# EAGLE design Debugger V1.1 (EAGLE 9.6.1)
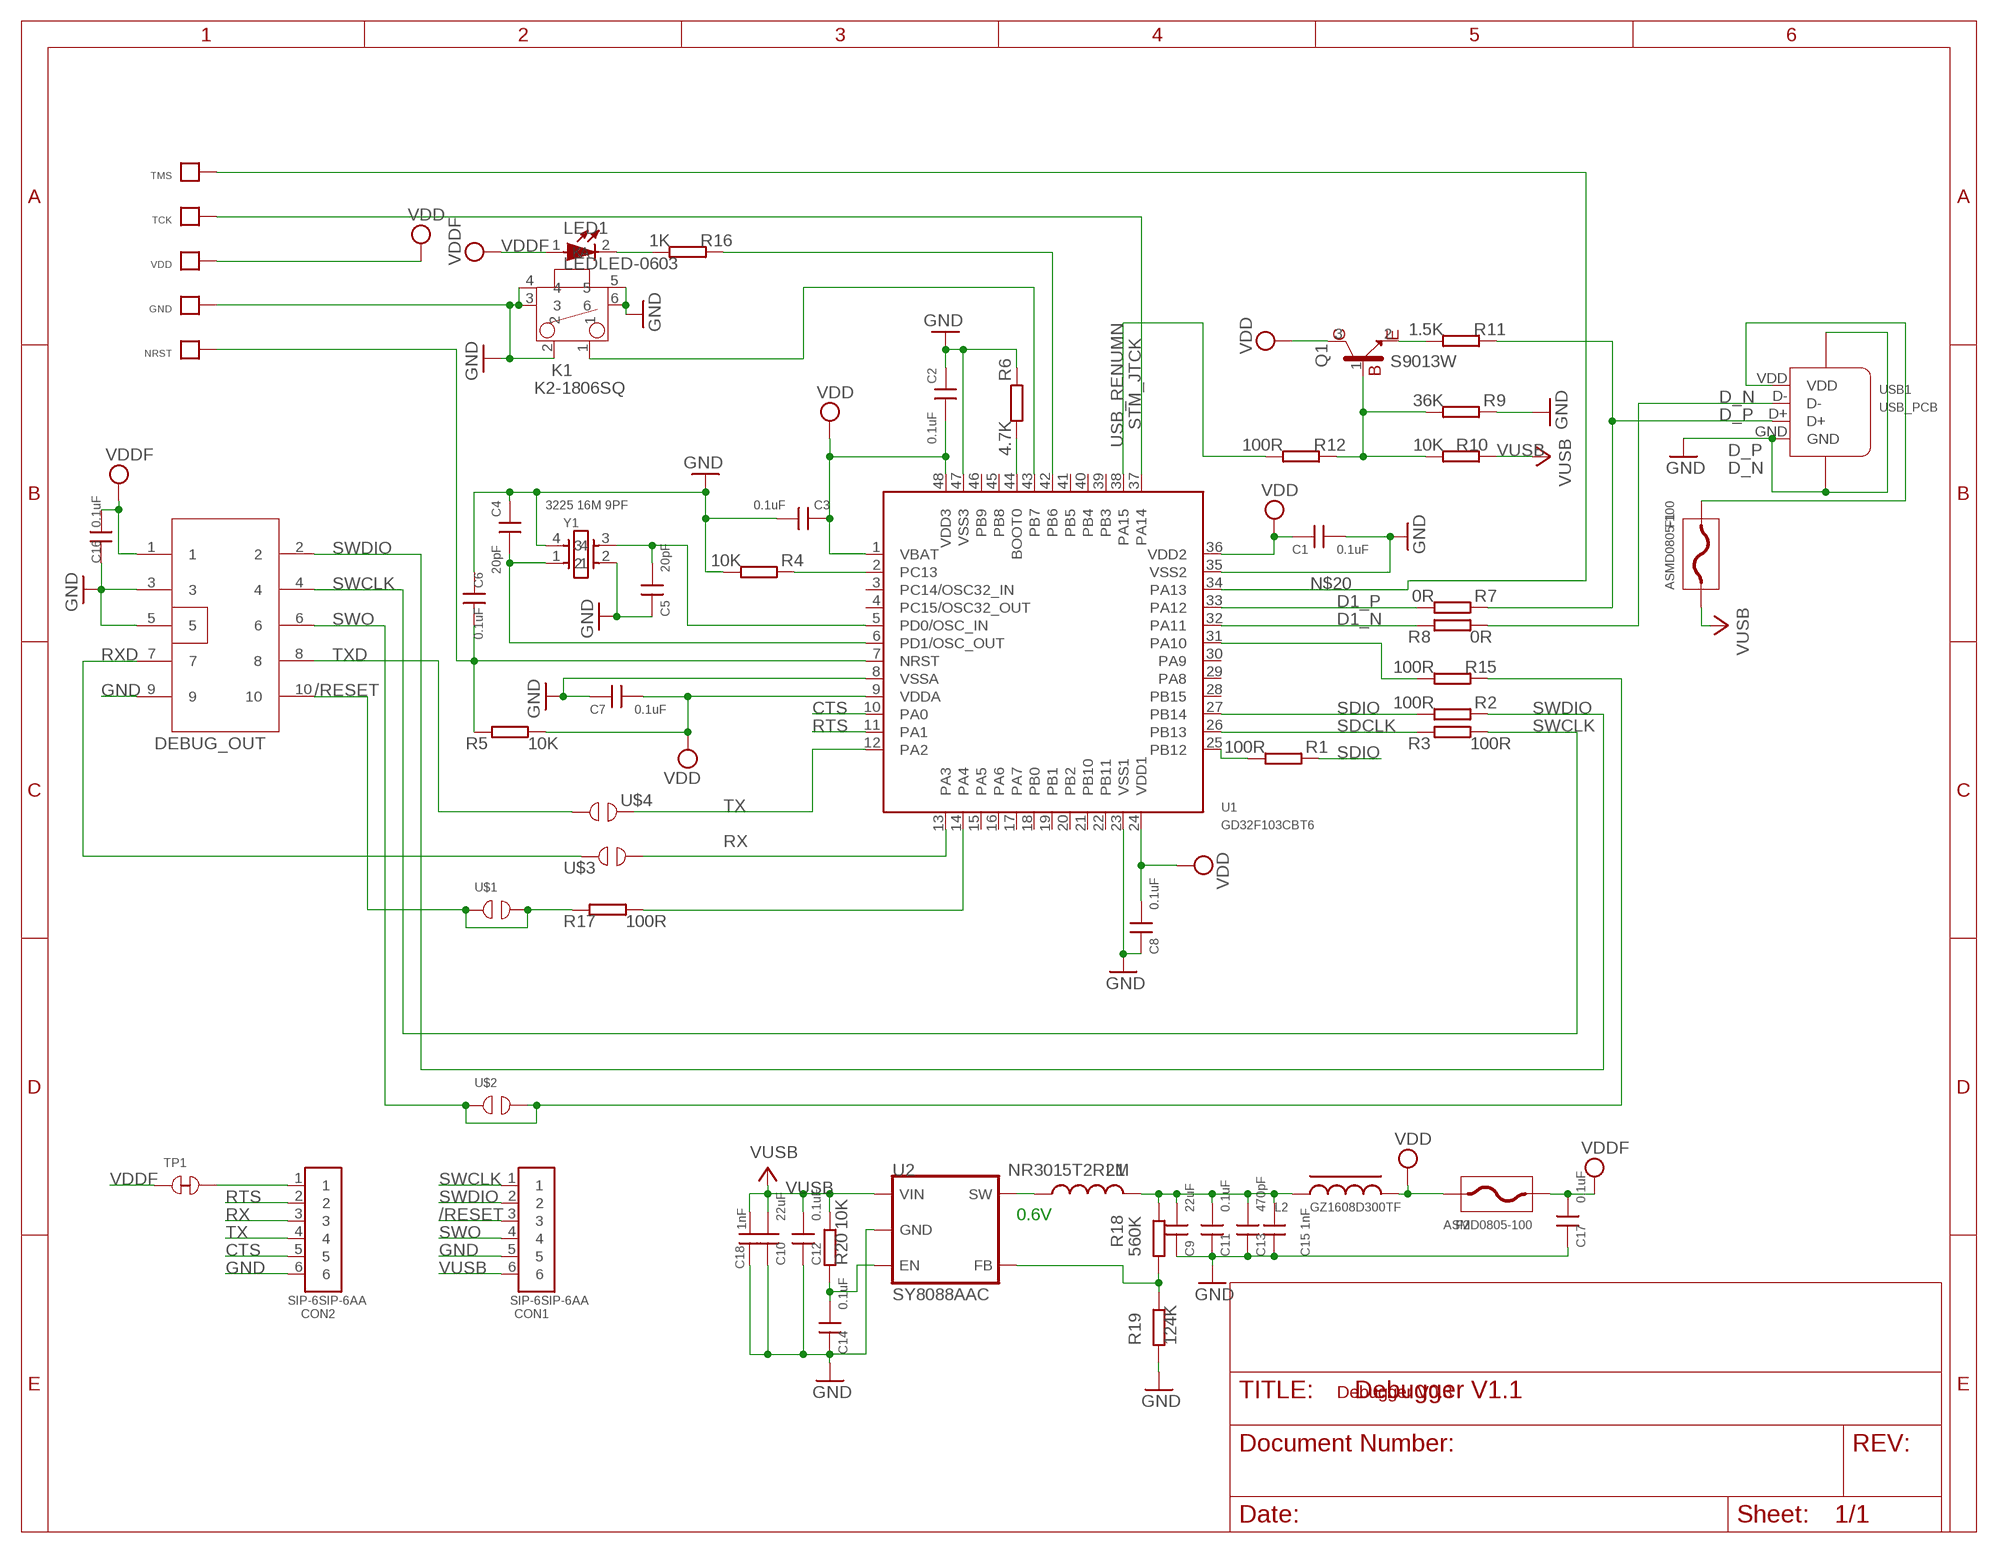
[diagram p0: schematic, sheet 1]

## Parts
C1  0.1uF  CAP0402A  [C0402]
C2  0.1uF  CAP0402A  [C0402]
C3  0.1uF  CAP0402A  [C0402]
C4  20pF  CAP0402A  [C0402]
C5  20pF  CAP0402A  [C0402]
C6  0.1uF  CAP0402A  [C0402]
C7  0.1uF  CAP0402A  [C0402]
C8  0.1uF  CAP0402A  [C0402]
C9  22uF  CAPC0805  [C0805]
C10  22uF  CAPC0805  [C0805]
C11  0.1uF  CAP0402A  [C0402]
C12  0.1uF  CAP0402A  [C0402]
C13  470pF  CAP0402A  [C0402]
C14  0.1uF  CAP0402A  [C0402]
C15  1nF  CAP0402A  [C0402]
C16  0.1uF  CAP0402A  [C0402]
C17  0.1uF  CAP0402A  [C0402]
C18  1nF  CAP0402A  [C0402]
CON1  SIP-6SIP-6AA  [PAIZHEN6P_2.54AA]
CON2  SIP-6SIP-6AA  [PAIZHEN6P_2.54AA]
DEBUG_OUT  CON5X2  [CON5X2_1.27]
F1  ASMD0805-100  FUSE  [F0805]
F2  ASMD0805-100  FUSE  [F0805]
GND  TPTP  [TP]
K1  K2-1806SQ  K2-1806C  [K2-1806C]
L1  NR3015T2R2M  INDUCTORB  [INDUCTOR-NR3015]
L2  GZ1608D300TF  L  [R-0603A]
LED1  LEDLED-0603  [LED-0603]
NRST  TPTP  [TP]
Q1  S9013W  NPNSOT-323  [SOT-323]
R1  100R  RES0402S  [R-0402S]
R2  100R  RES0402S  [R-0402S]
R3  100R  RES0402S  [R-0402S]
R4  10K  RES0402S  [R-0402S]
R5  10K  RES0402S  [R-0402S]
R6  4.7K  RES0402S  [R-0402S]
R7  0R  RES0402S  [R-0402S]
R8  0R  RES0402S  [R-0402S]
R9  36K  RES0402S  [R-0402S]
R10  10K  RES0402S  [R-0402S]
R11  1.5K  RES0402S  [R-0402S]
R12  100R  RES0402S  [R-0402S]
R15  100R  RES0402S  [R-0402S]
R16  1K  RES0402S  [R-0402S]
R17  100R  RES0402S  [R-0402S]
R18  560K  RES0402S  [R-0402S]
R19  124K  RES0402S  [R-0402S]
R20  10K  RES0402S  [R-0402S]
TCK  TPTP  [TP]
TMS  TPTP  [TP]
TP1  TP_SHORT  [TP_SHORT]
U1  GD32F103CBT6  STM32F103LQFP48  [LQFP-48-7X7]
U2  SY8088AAC  AX3701ABA  [SOT23-5L]
U$1  TP_OPEN  [TP_OPEN]
U$2  TP_OPEN  [TP_OPEN]
U$3  TP_OPEN  [TP_OPEN]
U$4  TP_OPEN  [TP_OPEN]
USB1  USB_PCB  [USB_PCB]
VDD  TPTP  [TP]
Y1  3225 16M 9PF  CRY-3225CRY-3225  [CRY_3225_SMT]

## Nets
/RESET: CON1.3 DEBUG_OUT.10 R17.1 U$1.1 U$1.2
CTS: CON2.5 U1.10(PA0)
D1_N: R8.1 U1.32(PA11)
D1_P: R7.2 U1.33(PA12)
D_N: R8.2 USB1.D-
D_P: R7.1 R11.1 USB1.D+
GND: C1.1 C2.2 C3.1 C4.2 C5.2 C6.2 C7.2 C8.2 C9.2 C10.2 C11.2 C12.2 C13.2 C14.2 C15.2 C16.2 C17.2 C18.2 CON1.5 CON2.6 DEBUG_OUT.3 DEBUG_OUT.5 DEBUG_OUT.9 GND.P$1 K1.2 K1.3 K1.4 K1.5 K1.6 R4.2 R6.1 R9.1 R19.1 U1.8(VSSA) U1.23(VSS1) U1.35(VSS2) U1.47(VSS3) U2.2(GND) USB1.GND USB1.GND1 USB1.GND2 Y1.2 Y1.4
N$1: R1.2 U1.25(PB12)
N$2: C6.1 NRST.P$1 R5.1 U1.7(NRST)
N$3: R4.1 U1.2(PC13)
N$5: C5.1 U1.5(PD0/OSC_IN) Y1.3
N$6: C4.1 U1.6(PD1/OSC_OUT) Y1.1
N$8: Q1.1(B) R9.2 R10.2 R12.1
N$9: R15.2 U1.31(PA10)
N$10: Q1.2(E) R11.2
N$11: R6.2 U1.44(BOOT0)
N$12: LED1.2(K) R16.2
N$13: F1.P$2 USB1.VDD
N$14: K1.1 U1.43(PB7)
N$15: R16.1 U1.42(PB6)
N$17: L1.1 U2.3(SW)
N$18: R17.2 U1.14(PA4)
N$20: TMS.P$1 U1.34(PA13)
N$21: R18.1 R19.2 U2.5(FB)
N$23: C14.1 R20.1 U2.1(EN)
N$24: C9.1 C11.1 C13.1 C15.1 L1.2 L2.1 R18.2
RTS: CON2.2 U1.11(PA1)
RX: CON2.3 U1.13(PA3) U$3.2
RXD: DEBUG_OUT.7 U$3.1
SDCLK: R3.1 U1.26(PB13)
SDIO: R1.1 R2.2 U1.27(PB14)
STM_JTCK: TCK.P$1 U1.37(PA14)
SWCLK: CON1.1 DEBUG_OUT.4 R3.2
SWDIO: CON1.2 DEBUG_OUT.2 R2.1
SWO: CON1.4 DEBUG_OUT.6 R15.1 U$2.1 U$2.2
TX: CON2.4 U1.12(PA2) U$4.1
TXD: DEBUG_OUT.8 U$4.2
USB_RENUMN: R12.2 U1.38(PA15)
VDD: C1.2 C2.1 C3.2 C7.1 C8.1 F2.P$2 L2.2 Q1.3(C) R5.2 U1.1(VBAT) U1.9(VDDA) U1.24(VDD1) U1.36(VDD2) U1.48(VDD3) VDD.P$1
VDDF: C16.1 C17.1 CON2.1 DEBUG_OUT.1 F2.P$1 LED1.1(A) TP1.1 TP1.2
VUSB: C10.1 C12.1 C18.1 CON1.6 F1.P$1 R10.1 R20.2 U2.4(VIN)
Unconnected: U1.3(PC14/OSC32_IN) U1.4(PC15/OSC32_OUT) U1.15(PA5) U1.16(PA6) U1.17(PA7) U1.18(PB0) U1.19(PB1) U1.20(PB2) U1.21(PB10) U1.22(PB11) U1.28(PB15) U1.29(PA8) U1.30(PA9) U1.39(PB3) U1.40(PB4) U1.41(PB5) U1.45(PB8) U1.46(PB9)

## Notes on the sheet
- 0.6V
- Debugger V0.3

## Library data of the parts
C1-C18 = RedBear:CAP: CAP
CON1 CON2 = RedBear:SIP-6: SIP-6
DEBUG_OUT = RedBear:CON5X2
F1 F2 = RedBear:FUSE
GND NRST TCK TMS VDD = RedBear:TP
K1 = RedBear:K2-1806C
L1 = Particle:INDUCTOR
L2 = RedBear:L
LED1 = RedBear DUO:LED: LED
Q1 = RedBear:NPN
R1-R12 R15-R20 = RedBear:RES: RES
TP1 = RedBear:TP_SHORT
U1 = RedBear:STM32F103
U2 = Particle:AX3701ABA
U$1-U$4 = RedBear:TP_OPEN
USB1 = RedBear:USB_PCB
Y1 = RedBear:CRY-3225: CRY-3225

## Board
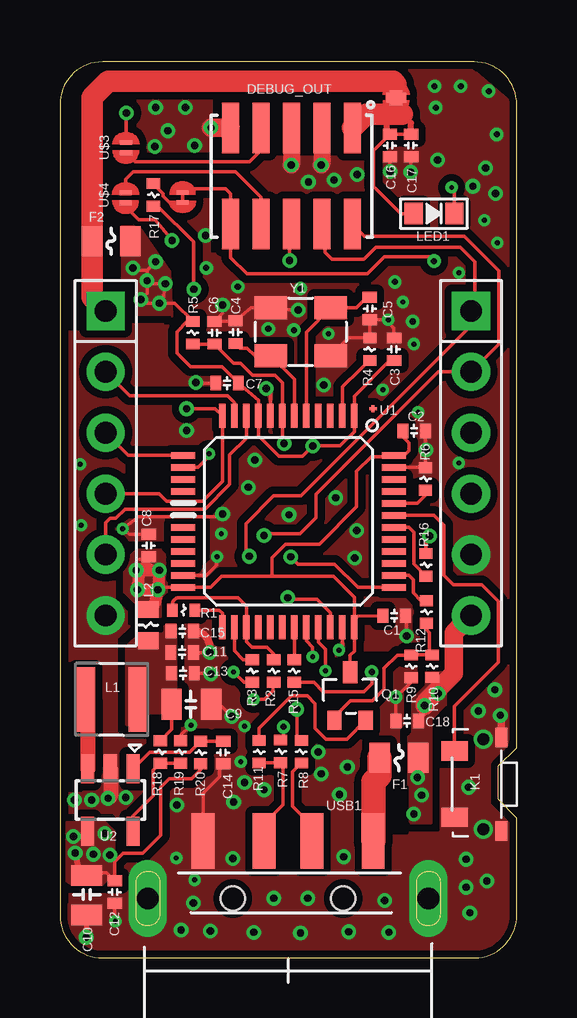
[diagram p1: board, top side]
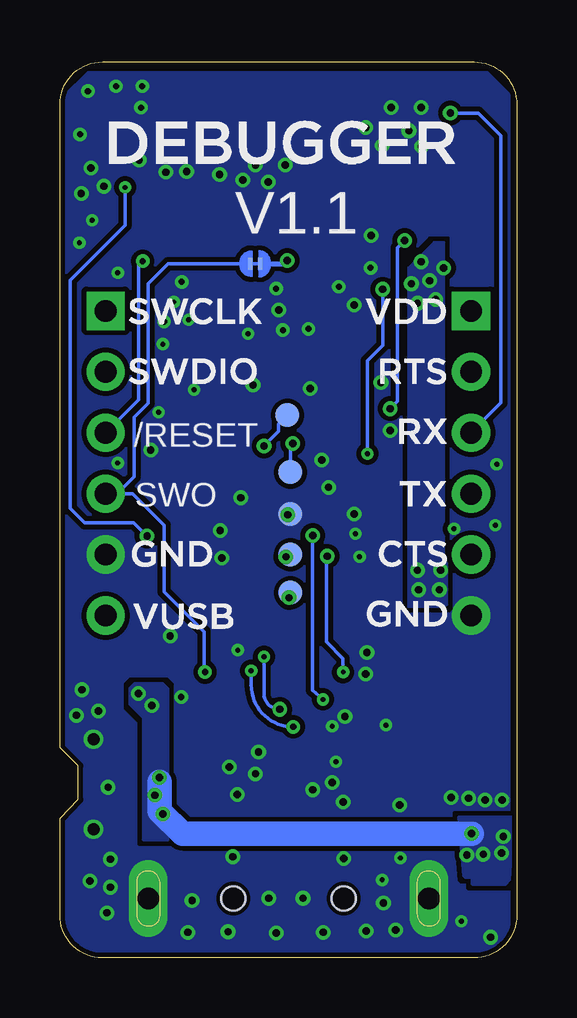
[diagram p2: board, bottom side, seen from below]

Size 19.05 x 37.34 mm. Coordinates in mm from the lower left corner, seen from the top.
Outline: 19.05,5.82 18.29,6.6 18.29,8 19.05,8.76 19.05,35.56 arc90 17.27,37.34 1.78,37.34 arc90 0,35.56 0,1.78 arc90 1.78,0 17.3,0 arc90 19.05,1.8 19.05,5.82
Copper layers (1*16): Top 0.035mm / dielectric 1.5mm / Bottom 0.035mm
Design rules "default *": minimum track width 6mil, minimum drill 0.2mm, track to track 6mil, track to pad 6mil, pad to pad 6mil, via to via 6mil, smd to smd 6mil, copper to edge 8mil, drill to drill 12mil, minimum pad ring 6mil, minimum via ring 6mil, stop-mask expansion 0.005mm, vias tented up to drill 16mil, thermal gap 4mil

### Footprints (pad centres in the part's own frame; a part is rotated, then mirrored left to right if it is on the bottom)
C0402 = smd 0.45 x 0.6: 1 -0.47,0; 2 0.47,0
C0805 = smd 0.85 x 1.3: 1 -0.8,0; 2 0.85,0
PAIZHEN6P_2.54AA = drill 0.9 pad 1.6 square: 1 0,0 | drill 0.9 pad 1.6: 2 0,-2.54; 3 0,-5.08; 4 0,-7.62; 5 0,-10.16; 6 0,-12.7
CON5X2_1.27 = smd 0.7 x 2.1: 1 -2.54,-2; 2 -2.54,2; 3 -1.27,-2; 4 -1.27,2; 5 0,-2; 6 0,2; 7 1.27,-2; 8 1.27,2; 9 2.54,-2; 10 2.54,2
F0805 = smd 0.85 x 1.25: P$1 -0.8,0; P$2 0.8,0
TP = smd 1 x 1: P$1 0,0
K2-1806C = smd 0.8 x 1.1: 1 -1.38,-1.2; 2 1.38,-1.2 | drill 0.5 pad 0.7: 3 1.875,0; 6 -1.875,0 | smd 0.8 x 0.5: 4 1.95,0.75; 5 -1.95,0.75
INDUCTOR-NR3015 = smd 0.8 x 2.7: 1 -1.1,0; 2 1.1,0
R-0603A = smd 0.7 x 0.85: 1 -0.65,0; 2 0.65,0
LED-0603 = smd 0.762 x 0.889: 1 -0.85,0; 2 0.85,0
SOT-323 = smd 0.6 x 0.8: 1 -0.65,-1; 2 0.65,-1 | smd 0.6 x 0.9: 3 0,1
R-0402S = smd 0.45 x 0.55: 1 -0.47,0; 2 0.47,0
TP_SHORT = smd 0.2 x 0.5: 1 -0.21,0; 2 0.21,0 | smd 0.4 x 0.8: P$1 0,0
LQFP-48-7X7 = smd 1 x 0.27: 1 -4.4,2.75; 2 -4.4,2.25; 3 -4.4,1.75; 4 -4.4,1.25; 5 -4.4,0.75; 6 -4.4,0.25; 7 -4.4,-0.25; 8 -4.4,-0.75; 9 -4.4,-1.25; 10 -4.4,-1.75; 11 -4.4,-2.25; 12 -4.4,-2.75; 25 4.4,-2.75; 26 4.4,-2.25; 27 4.4,-1.75; 28 4.4,-1.25; 29 4.4,-0.75; 30 4.4,-0.25; 31 4.4,0.25; 32 4.4,0.75; 33 4.4,1.25; 34 4.4,1.75; 35 4.4,2.25; 36 4.4,2.75 | smd 0.27 x 1: 13 -2.75,-4.4; 14 -2.25,-4.4; 15 -1.75,-4.4; 16 -1.25,-4.4; 19 0.25,-4.4; 20 0.75,-4.4; 21 1.25,-4.4; 22 1.75,-4.4; 23 2.25,-4.4; 24 2.75,-4.4; 37 2.75,4.4; 38 2.25,4.4; 39 1.75,4.4; 40 1.25,4.4; 41 0.75,4.4; 42 0.25,4.4; 43 -0.25,4.4; 44 -0.75,4.4; 45 -1.25,4.4; 46 -1.75,4.4; 47 -2.25,4.4; 48 -2.75,4.4 | smd 0.127 x 0.3: 17 -4.694,3.538 | smd 0.3 x 0.127: 18 -4.692,3.534
SOT23-5L = smd 0.55 x 1.2: 1 -0.95,-1.3; 2 0,-1.3; 3 0.95,-1.3; 4 0.95,1.3; 5 -0.95,1.3
TP_OPEN = smd 0.2 x 0.5: 1 -0.21,0; 2 0.21,0
USB_PCB = smd 0.95 x 2.3: D+ -1.009,5.384; D- 0.991,5.384; GND -3.559,5.384; VDD 3.541,5.384 | drill 0.9 pad 1.6 long: GND1 5.841,2.984; GND2 -5.859,2.984 | hole 1: -2.309,2.984; 2.291,2.984
CRY_3225_SMT = smd 1.35 x 0.95: 1 -1.25,-1; 2 1.25,-1; 3 1.25,1; 4 -1.25,1

### Placement (x,y rotation side)
C1  13.94,14.26 180 top
C2  14.77,21.96 0 top
C3  13.93,25.36 270 top
C4  7.32,26.07 90 top
C5  12.92,27.06 270 top
C6  6.45,26.05 90 top
C7  6.97,23.95 180 top
C8  3.71,17.18 90 top
C9  5.46,10.57 0 top
C10  1.12,2.64 270 top
C11  5.1,12.73 0 top
C12  2.29,2.74 270 top
C13  5.13,11.86 0 top
C14  6.81,8.56 270 top
C15  5.11,13.61 0 top
C16  13.76,33.85 270 top
C17  14.64,33.85 270 top
C18  14.48,9.88 180 top
CON1  17.14,26.96 0 top
CON2  1.91,26.96 0 top
DEBUG_OUT  9.65,32.58 180 top
F1  14.13,8.34 180 top
F2  2.13,29.87 0 top
GND  9.44,18.49 180 bottom
K1  17.65,7.24 270 top
L1  2.16,10.77 0 top
L2  3.68,13.87 90 top
LED1  15.6,31.01 0 top
NRST  9.44,20.24 0 bottom
Q1  12.1,10.9 0 top
R1  5.16,14.49 0 top
R2  8.92,11.95 90 top
R3  8.02,11.95 270 top
R4  12.92,25.36 90 top
R5  5.55,26.05 90 top
R6  15.24,19.96 270 top
R7  9.2,8.61 90 top
R8  10.07,8.59 270 top
R9  14.64,12.15 90 top
R10  15.52,12.15 90 top
R11  8.31,8.59 90 top
R12  15.28,14.41 90 top
R15  9.77,11.95 90 top
R16  15.27,16.38 90 top
R17  3.89,31.8 270 top
R18  4.19,8.59 90 top
R19  5.03,8.59 270 top
R20  5.87,8.56 270 top
TCK  9.44,16.81 0 bottom
TMS  9.44,15.22 0 bottom
TP1  14.02,35.84 90 top
U1  9.53,18.19 270 top
U2  2.11,6.58 180 top
U$1  5.11,31.69 270 top
U$2  10.91,28.93 180 bottom
U$3  2.75,33.77 90 top
U$4  2.74,31.68 90 top
U$5  SPARK_LOGO2  [SPARK_LOGO2]  10.62,6.16 0 bottom
U$6  SPARK_LOGO2  [SPARK_LOGO2]  15.8,33.59 0 top
USB1  9.53,-0.51 0 top
VDD  9.56,22.61 0 bottom
Y1  10.04,26.09 0 top

### Tracks (layer width: path | path; a pad name or v marks a point on that pad's centre or on a via)
/RESET  (via drill 0.25 pad 0.51)
  Top 0.152: R17.1 4.31,31.85 4.31,31.73 4.57,31.48 U$1.2 U$1.1 5.27,32.05 6.91,32.05 7.11,31.85 DEBUG_OUT.10 7.11,29.18 7.8,28.5 12.83,28.5 13.54,29.21 15.42,29.21 v15.6,29.03
  Bottom 0.152: CON1.3 15.77,23.25 15.77,28.85 v15.6,29.03
CTS
  Top 0.152: U1.10 7.78,21.66 7.08,20.97 7.08,19.73 6.04,18.69 2.71,18.69 2.33,18.31 2.08,18.31 1.91,18.14 CON2.5
D1_N  (via drill 0.2 pad 0.41, 0.3 pad 0.51)
  Top 0.152: R8.1 arc-90 9.88,9.25 v9.88,10.36 | U1.32 10.28,13.22 10.54,12.95 v10.54,12.55
  Bottom 0.152: v10.54,12.55 10.54,11.02 arc-90 v9.88,10.36
D1_P  (via drill 0.2 pad 0.41, 0.25 pad 0.51)
  Top 0.152: 9.32,9.2 arc-90 R7.2 9.32,9.2 | U1.33 10.78,13.15 11.07,12.85 11.07,12.12 v11.07,11.96 | 9.32,9.2 v9.32,9.63
  Bottom 0.152: v11.07,11.96 11.07,11.38 arc-90 v9.32,9.63
D_N
  Top 0.152: R8.2 9.7,7.76 9.7,6.32 9.93,6.1 10.52,5.51 USB1.D-
D_P
  Top 0.152: R11.1 9.19,8.12 R7.1 9.31,8.03 9.31,6.39 8.66,5.74 8.66,5.03 USB1.D+
GND  (via drill 0.2 pad 0.41, 0.25 pad 0.51, 0.3 pad 0.51)
  Top 0.152: Y1.2 12.03,25.83 R4.2 C5.2 v13.69,26.59 13.69,26.48 13.93,26.24 C3.1 | USB1.GND 5.97,5.18 5.97,5.19 5.97,6.86 6.66,7.54 6.66,7.94 C14.2 | C1.1 arc-90 14.45,14.21 v14.45,13.41 | U1.8 8.78,23.56 v8.61,23.72 | C7.2 5.69,23.95 v5.66,23.98 | v9.93,27 8.88,27 Y1.4 7.97,27.09 C4.2 7.3,26.52 C6.2 6.78,26.86 v6.78,27.2 | C16.2 v13.76,32.77 v13.77,32.77 | C17.2 14.63,33.37 v14.63,32.74 | C9.2 6.65,10.57 v7.16,10.06 | C8.2 2.9,17.65 v2.62,17.88 3.28,18.39 6.68,18.39 v6.78,18.49 | C2.2 15.24,21.18 v15.27,21.16 15.24,21.13 R6.1 15.23,20.44 U1.47 | U1.35 11.78,12.97 v11.63,12.83 | C18.2 14.01,10.86 | v14,10.87 14.01,10.86 | v5.46,9.7 5.03,9.27 R19.1 | C12.2 2.29,1.55 v2.31,1.52 | v6.55,16.71 6.53,16.69 6.53,16.36 6.11,15.94 U1.23 | C11.2 v6.25,12.73 | C13.2 6.27,11.86 v6.3,11.84 | R9.1 14.64,11.49 14.01,10.86
  Top 0.203: C10.2 1.09,1.77 v1.09,0.86
  Top 0.305: C15.2 arc-90 6.25,12.94 v6.25,12.73 | K1.5 18.4,10.07 v18.36,10.11
  Top 0.635: U2.2 2.11,6.76 v2.01,6.66
  Top 0.711: DEBUG_OUT.5 v9.65,33.05 | DEBUG_OUT.3 10.92,33.07 v10.9,33.05
  Top 0.762: DEBUG_OUT.9 6.31,34.58 v6.3,34.6
  other vias: 16.94,4.11 17.09,1.88 14.71,26.52 12.37,17.81 4.88,6.38 7.7,7.32 10.34,2.49 10.9,7.67 8.92,2.49 5.56,2.29 11.66,6.81 11.51,19.18 8.13,20.75 17.04,7.11 1.32,6.58 0.61,6.58 6.07,30.1 2.74,6.68 11,23.88 17.81,3.2 13.54,2.39 6.27,1.12 12.04,1.09 12.29,16.66 11.99,7.95 10.77,8.59 8.51,7.01 7.24,6.5 8.08,1.07 10.03,1.04 13.72,1.07 16.94,2.95 11.84,4.22 7.21,4.14 7.85,19.61 9.55,18.47 10.36,32.33 11.43,32.41 12.4,32.64 15.75,33.25 17.75,32.92 17.22,32.16 18.16,31.85 5.61,33.86 5.23,35.43 3.99,35.43 4.5,34.47 3.96,33.81 17.45,10.29 18.14,11.18 5.28,21.97 11.2,26.01 13.46,23.67 16.64,28.55 14.3,27.33 14.94,22.73 16.64,20.62 0.89,18.03 0.84,20.57 6.73,17.68 7.7,9.65 7.54,8.18 6.1,28.75 17.7,30.73 4.85,4.17 5.61,3.25 5.05,1.17 15.62,36.32 16.71,36.32 15.67,35.43 17.88,36.12 18.21,34.32 18.24,29.79 7.42,27.97 10.03,27.89 13.97,28.17 9.75,26.16 8.69,26.21 14.76,25.58
  cutout Top: 1.78,30.51 1.78,28.32 1.91,28.19 2.54,28.19 2.54,30.51
  pour Top (isolate 0.305, rank 3, no thermals): 0.36,2.21 0.36,0.33 0.41,0.28 18.44,0.28 18.75,0.58 18.75,5.56 17.91,6.4 17.91,8.15 18.59,8.59 18.87,10.34 18.9,35.56 17.37,36.86 17.3,36.86 17.09,37.06 1.68,37.06 0.43,35.81 0.43,2.29
  pour Bottom (isolate 0.203, rank 3, no thermals): 0.3,0.25 18.36,0.25 18.85,0.74 18.85,5.77 18.82,5.79 18.08,6.53 18.08,7.62 18.08,8.13 18.85,8.89 18.85,35.92 17.88,36.88 1.27,36.88 1.24,36.91 0.33,35.99 0.33,0.3
  cutout Top (isolate 0.203): 13.44,15.29 12.93,15.29 12.93,20.47 13.16,20.7 13.44,20.7
  cutout Top (isolate 0.203): 5.56,16.41 5.61,21.29 6.2,21.29 6.2,16.61 6.02,16.43 5.82,16.43 5.79,16.41
  cutout Top: 10.52,15.06 10.52,14.3 12.42,14.3 12.42,15.09 10.54,15.09
  cutout Top: 9.02,5.99 9.04,3.56 10.06,3.56 10.08,3.81 10.08,5.99
  cutout Top: 8.1,8.86 8.1,8.36 8.13,8.33 10.29,8.33 10.29,8.86
  cutout Top (isolate 0.254): 6.43,36.09 6.43,33.48 12.55,33.48 12.55,36.09
  cutout Top (isolate 0.254): 6.35,31.7 6.35,29.44 12.9,29.44 12.9,31.7
  pour Top (isolate 0.203): 7.8,12.22 7.8,11.71 10.21,11.71 10.21,12.22 10.19,12.24 7.8,12.24
  cutout Top: 0.1,36.32 0.1,26.24 0.15,26.19 0.91,26.19 0.91,36.3 0.89,36.32
N$1
  Top 0.152: R1.2 6.64,14.49 6.78,14.36 U1.25
N$2  (via drill 0.3 pad 0.51)
  Top 0.152: v9.35,21.44 9.28,21.51 U1.7 9.28,23.97 8.97,24.28 8.04,24.28 7.54,24.78 7.24,24.78 C6.1 R5.1
  Bottom 0.152: NRST.P$1 9.44,21.35 v9.35,21.44
N$3
  Top 0.152: U1.2 11.78,23.81 12.51,24.5 12.9,24.89 R4.1
N$4
  cutout Top (isolate 0.305): 2.79,20.83 2.79,18.8 4.57,18.8 4.57,20.83
N$5
  Top 0.152: U1.5 10.28,26.08 Y1.3 12.36,27.09 12.8,27.53 C5.1
N$6
  Top 0.152: U1.6 9.78,24.11 Y1.1 8.13,25.09 7.81,25.41 7.51,25.41 C4.1
N$7
  cutout Top (isolate 0.254): 7.8,12.27 7.8,11.73 10.74,11.73 10.74,12.27
N$8
  Top 0.152: R12.1 15.28,13.69 15.41,13.56 15.41,12.73 R10.2 R9.2 14.07,12.62 13.51,12.07 13.51,11.2 13.03,10.72 12.11,10.72 11.45,10.06 Q1.1
N$9
  Top 0.152: R15.2 | R15.2 U1.31
N$10
  Top 0.152: R11.2 8.3,9.57 9.65,10.92 10.31,10.92 10.64,10.59 10.64,9.58 11.1,9.12 11.96,9.12 Q1.2
N$11
  Top 0.152: U1.44 14.9,18.94 15.24,19.28 R6.2
N$12  (via drill 0.2, 0.3 pad 0.51)
  Top 0.152: R16.2 15.27,17.43 v15.42,17.58 | LED1.2 16.45,31.99 v16.33,32.11
  Bottom 0.152: v15.42,17.58 15.98,18.14 18.01,18.14 18.62,18.74 18.62,28.24 16.33,30.53 v16.33,32.11
N$13
  Top 1.016: USB1.VDD 13.07,7.33 13.33,7.59 F1.P$2
N$14
  Top 0.152: K1.1 16.45,10.48 18.29,12.32 18.29,14.86 17.6,15.55 16.41,15.55 16,15.95 16,18.03 15.6,18.44 U1.43
N$15
  Top 0.152: R16.1 14.76,16.42 14.76,17.73 14.55,17.94 U1.42
N$17
  Top 0.635: L1.1 1.16,10.67 U2.3
N$18  (via drill 0.2 pad 0.41, 0.3 pad 0.51)
  Top 0.152: U1.14 5.77,20.44 6.22,20.89 v6.22,21.01 | R17.2 4.08,31.33 5.56,29.84 5.56,27.89 v5.59,27.86
  Bottom 0.152: v5.59,27.86 5.59,25.53 6.22,24.89 v6.22,21.01
N$19
  cutout Top (isolate 0.305): 13.72,7.11 13.72,5.21 14.48,5.21 14.48,7.11
N$20  (via drill 0.3 pad 0.51)
  Top 0.152: U1.34 11.28,14.38 10.72,14.93 9.58,14.93 v9.5,15.01
  Bottom 0.152: TMS.P$1 9.5,15.16 v9.5,15.01
N$21
  Top 0.152: U2.5 3.06,5.93 3.89,6.76 3.89,7.81 R18.1 R19.2
N$22
  cutout Top (isolate 0.305): 12.7,12.7 12.7,11.43 13.34,11.43 13.59,11.43 13.59,12.7
N$23
  Top 0.152: U2.1 3.75,8.57 5.41,8.57 R20.1 C14.1
N$24
  Top 0.152: R18.2 4.66,9.52 C9.1
  pour Top (isolate 0.203, no thermals): 2.77,12.55 2.77,9.73 2.79,9.7 3.58,9.7 3.66,9.78 3.66,10.13 3.71,10.19 4.83,10.19 4.85,10.21 4.85,13.84 4.83,13.87 4.42,13.87 4.37,13.82 4.37,13.61 4.27,13.51 3.3,13.51 2.77,12.98
N$25
  cutout Top (isolate 0.305): 0.25,8.64 0.25,6.99 0.89,6.99 0.89,8.64
RTS
  Top 0.152: U1.11 7.28,23.13 6.99,23.42 2.91,23.42 CON2.2
RX  (via drill 0.3 pad 0.51)
  Top 0.152: U1.13 2.85,20.94 CON2.3 | v2.77,35.2 2.74,35.2 2.75,35.2 U$3.2
  Bottom 0.152: CON2.3 0.66,23.13 0.66,34.27 1.6,35.2 v2.77,35.2
RXD
  Top 0.152: U$3.1 3.13,33.17 7.9,33.17 8.38,33.66 DEBUG_OUT.7
SDCLK
  Top 0.152: U1.26 7.28,12.79 7.64,12.42 R3.1
SDIO
  Top 0.152: R2.2 8.92,12.67 8.64,12.95 8,12.95 7.78,13.18 U1.27 7.78,14.65 7.42,15.01 4.98,15.01 arc90 4.69,14.72 R1.1
STM_JTCK  (via drill 0.3 pad 0.51)
  Top 0.152: U1.37 12.43,15.44 11.46,16.41 9.93,16.41 v9.63,16.71
  Bottom 0.152: TCK.P$1 9.53,16.81 v9.63,16.71
SWCLK  (via drill 0.2 pad 0.41, 0.3 pad 0.51)
  Top 0.152: v7.9,16.74 7.76,16.88 7.76,18.1 8.92,19.25 10.06,19.25 17.14,26.34 CON1.1 17.3,27.12 17.3,29.01 16.69,29.62 13.18,29.62 12.68,29.11 11.35,29.11 11.05,29.41 11.05,30.45 DEBUG_OUT.4 | v7.24,11.91 7.67,11.48 R3.2
  Bottom 0.152: v7.24,11.91 7.24,12.47 7.94,13.17 7.94,16.7 v7.9,16.74
SWDIO  (via drill 0.2 pad 0.41, 0.3 pad 0.51)
  Top 0.152: R2.1 8.89,11.46 8.89,11.12 8.53,10.77 v8.08,10.77 | DEBUG_OUT.2 12.7,30.07 16.87,30.07 18.3,28.64 18.3,25.58 CON1.2 15.77,24.42 10.67,19.32 10.67,18.34 10.01,17.68 8.59,17.68 v8.51,17.6
  Bottom 0.152: v8.08,10.77 8.51,11.15 v8.51,17.6
SWO  (via drill 0.25 pad 0.51, 0.3 pad 0.51)
  Top 0.152: DEBUG_OUT.6 9.65,29.62 9.58,29.54 v9.58,29.06 | R15.1 10.59,11.48 10.97,11.1 12.68,11.1 13.01,11.43 v13.01,11.91
  Bottom 0.152: U$2.1 U$2.2 14.53,28.93 15.37,28.09 15.37,23.11 15.95,22.53 15.95,20.05 16.66,19.34 CON1.4 16.02,19.34 14.71,18.03 14.71,15.27 13.03,13.59 13.03,11.94 v13.01,11.91
  Bottom 0.203: U$2.1 9.71,28.93 v9.58,29.06
TX  (via drill 0.3 pad 0.51)
  Top 0.152: U$4.1 2.74,31.3 3.28,30.76 3.96,30.76 v4.67,29.9 | v5.28,22.88 6.48,22.88 U1.12 6.78,19.86 5.94,19.02 4.45,19.02 4.13,19.34 CON2.4
  Bottom 0.152: v4.67,29.9 4.98,29.59 4.98,23.19 v5.28,22.88
TXD
  Top 0.152: U$4.2 2.74,32.45 3.05,32.77 7.32,32.77 8.38,31.7 DEBUG_OUT.8
USB_RENUMN
  Top 0.152: U1.38 14.54,15.94 14.73,15.75 14.73,15.21 15.05,14.89 R12.2
VDD  (via drill 0.3 pad 0.51)
  Top 0.152: U1.36 12.28,14.1 12.42,14.24 C1.2 | v4.09,15.34 4.08,15.44 U1.24 6.27,15.44 6.74,15.9 8.84,15.9 | C8.1 3.46,16.61 3.33,16.61 | U1.36 12.28,15.03 11.41,15.9 8.84,15.9 | v4.14,27.28 4.29,27.43 v4.39,28.09 3.76,28.09 v3.63,28.22 | C2.1 14.3,21.72 14.55,21.46 14.55,21.13 14.36,20.94 U1.48 13.87,20.88 12.98,20.88 12.37,20.27 12.37,18.8 10.82,17.25 9.41,17.25 8.84,16.68 8.84,15.9 | v4.14,27.28 4.79,27.28 R5.2 5.31,26.52 4.88,26.09 4.88,25.2 5.44,24.63 6.76,24.63 C7.1 8.28,23.25 U1.9 8.28,21.75 9.13,20.9 10.11,20.9 v10.54,21.34 11.68,21.34 12.28,21.93 U1.1 12.28,23.41 13.76,24.89 C3.2 | Q1.3 12.1,12.61 12.28,12.79 U1.36 | v4.14,27.28 3.53,27.28 v3.38,27.43 3.63,27.69 v3.63,28.22 | v3.99,29.01 3.63,28.65 | 3.63,28.65 v3.63,28.22 | v3.05,28.75 3.15,28.65 3.63,28.65
  Top 0.254: C8.1 3.55,16.44 | 3.55,16.44 v4.14,16.15 | v3.18,16.15 3.33,16.21 3.55,16.44
  Top 0.508: L2.2 3.99,14.82 v4.09,15.34 | v4.09,15.34 v3.23,15.34 3.28,15.95 v3.18,16.15 v4.14,16.15 v4.09,15.34
  Bottom 0.152: v10.54,21.34 9.93,21.95 9.93,22.25 VDD.P$1
  pour Top (isolate 0.203, no thermals): 3.18,14.22 3.18,14.73 2.67,15.24 2.67,16.26 2.67,16.51 2.92,16.76 3.18,17.02 4.19,17.02 4.45,16.76 4.45,15.24 4.19,14.99 4.19,14.22
  pour Top (isolate 0.203, no thermals): 2.51,30.48 2.57,28.32 2.59,28.3 3.2,28.3 3.2,26.8 4.62,26.8 4.67,26.75 4.6,28.6 3.28,30.48
  pour Bottom (isolate 0.203, no thermals): 3.18,14.63 4.32,14.63 4.52,14.63 4.52,28.75 3.45,29.82 3.05,29.82 3.05,16.59 2.92,16.46 2.92,14.86 2.92,14.71 3,14.63 3.15,14.63
VDDF
  Top 0.152: C17.1 14.63,34.32 C16.1 13.08,33.64 13.08,32.16 14.22,31.01 LED1.1
  Top 0.254: C16.1 13.63,34.45 13.63,35.14 | C17.1 14.64,34.78 14.28,35.14 | TP1.1 14.02,35.14
  Top 0.889: CON2.1 1.35,27.52 1.33,27.52 F2.P$1 1.35,29.88 1.35,35.87 2.01,36.53 13.9,36.53 14.02,36.39 TP1.1 TP1.2 | DEBUG_OUT.1 12.77,35.15 13.62,35.15 13.63,35.14 14.02,35.14 14.28,35.14
VUSB  (via drill 0.3 pad 0.51)
  Top 0.152: 1.22,3.54 1.96,3.54 C12.1 2.29,4.01 2.64,4.37 3.45,4.37 4.19,5.11 4.19,7.11 4.55,7.47 5.49,7.47 5.87,7.85 R20.2 | C18.1 15.21,10.15 15.21,10.64
  Top 0.254: 1.22,3.54 C10.1 0.79,3.77 v0.63,4.37
  Top 0.508: F1.P$1 14.93,7.54 v14.91,7.52
  Top 0.762: CON1.6 16.43,13.55 16.43,11.86 15.21,10.64 v15.21,10.52
  Bottom 1.016: 14.88,7.34 14.88,6.12 13.95,5.18 v1.88,5.18
  other vias: 2.08,4.29 15.09,6.78 14.76,5.99 15.77,11.02 1.4,4.32 0.56,5.05
  pour Bottom (isolate 0.203): 14.55,4.93 15.57,4.93 15.57,10.01 16.13,10.57 16.13,11.23 15.93,11.43 14.77,11.43 14.55,11.21
  pour Bottom (no thermals): 0.15,5.87 0.3,3.25 0.48,3.07 1.78,3.07 1.8,3.05 1.85,3.1 1.85,3.35 2.13,3.35 2.21,3.43 2.41,5.87
  pour Top (isolate 0.203, no thermals): 0.28,3.23 0.48,3.07 1.75,3.07 2.24,3.56 2.24,5 2.24,5.28 1.88,5.64 0.28,5.64 0.25,5.61
  pour Top (isolate 0.203, no thermals): 15.27,11.91 15.27,11.35 14.71,10.8 14.71,9.4 14.53,9.22 14.53,5.71 14.63,5.61 15.47,5.61 15.49,5.64 15.49,9.93 16.1,10.54 16.1,11.91

### Text on the board
tPlace: LED1 | USB1
bPlace: V1.1 | /RESET | SWO